# Altium schematic sheet sensing_circuits.SchDoc
size B
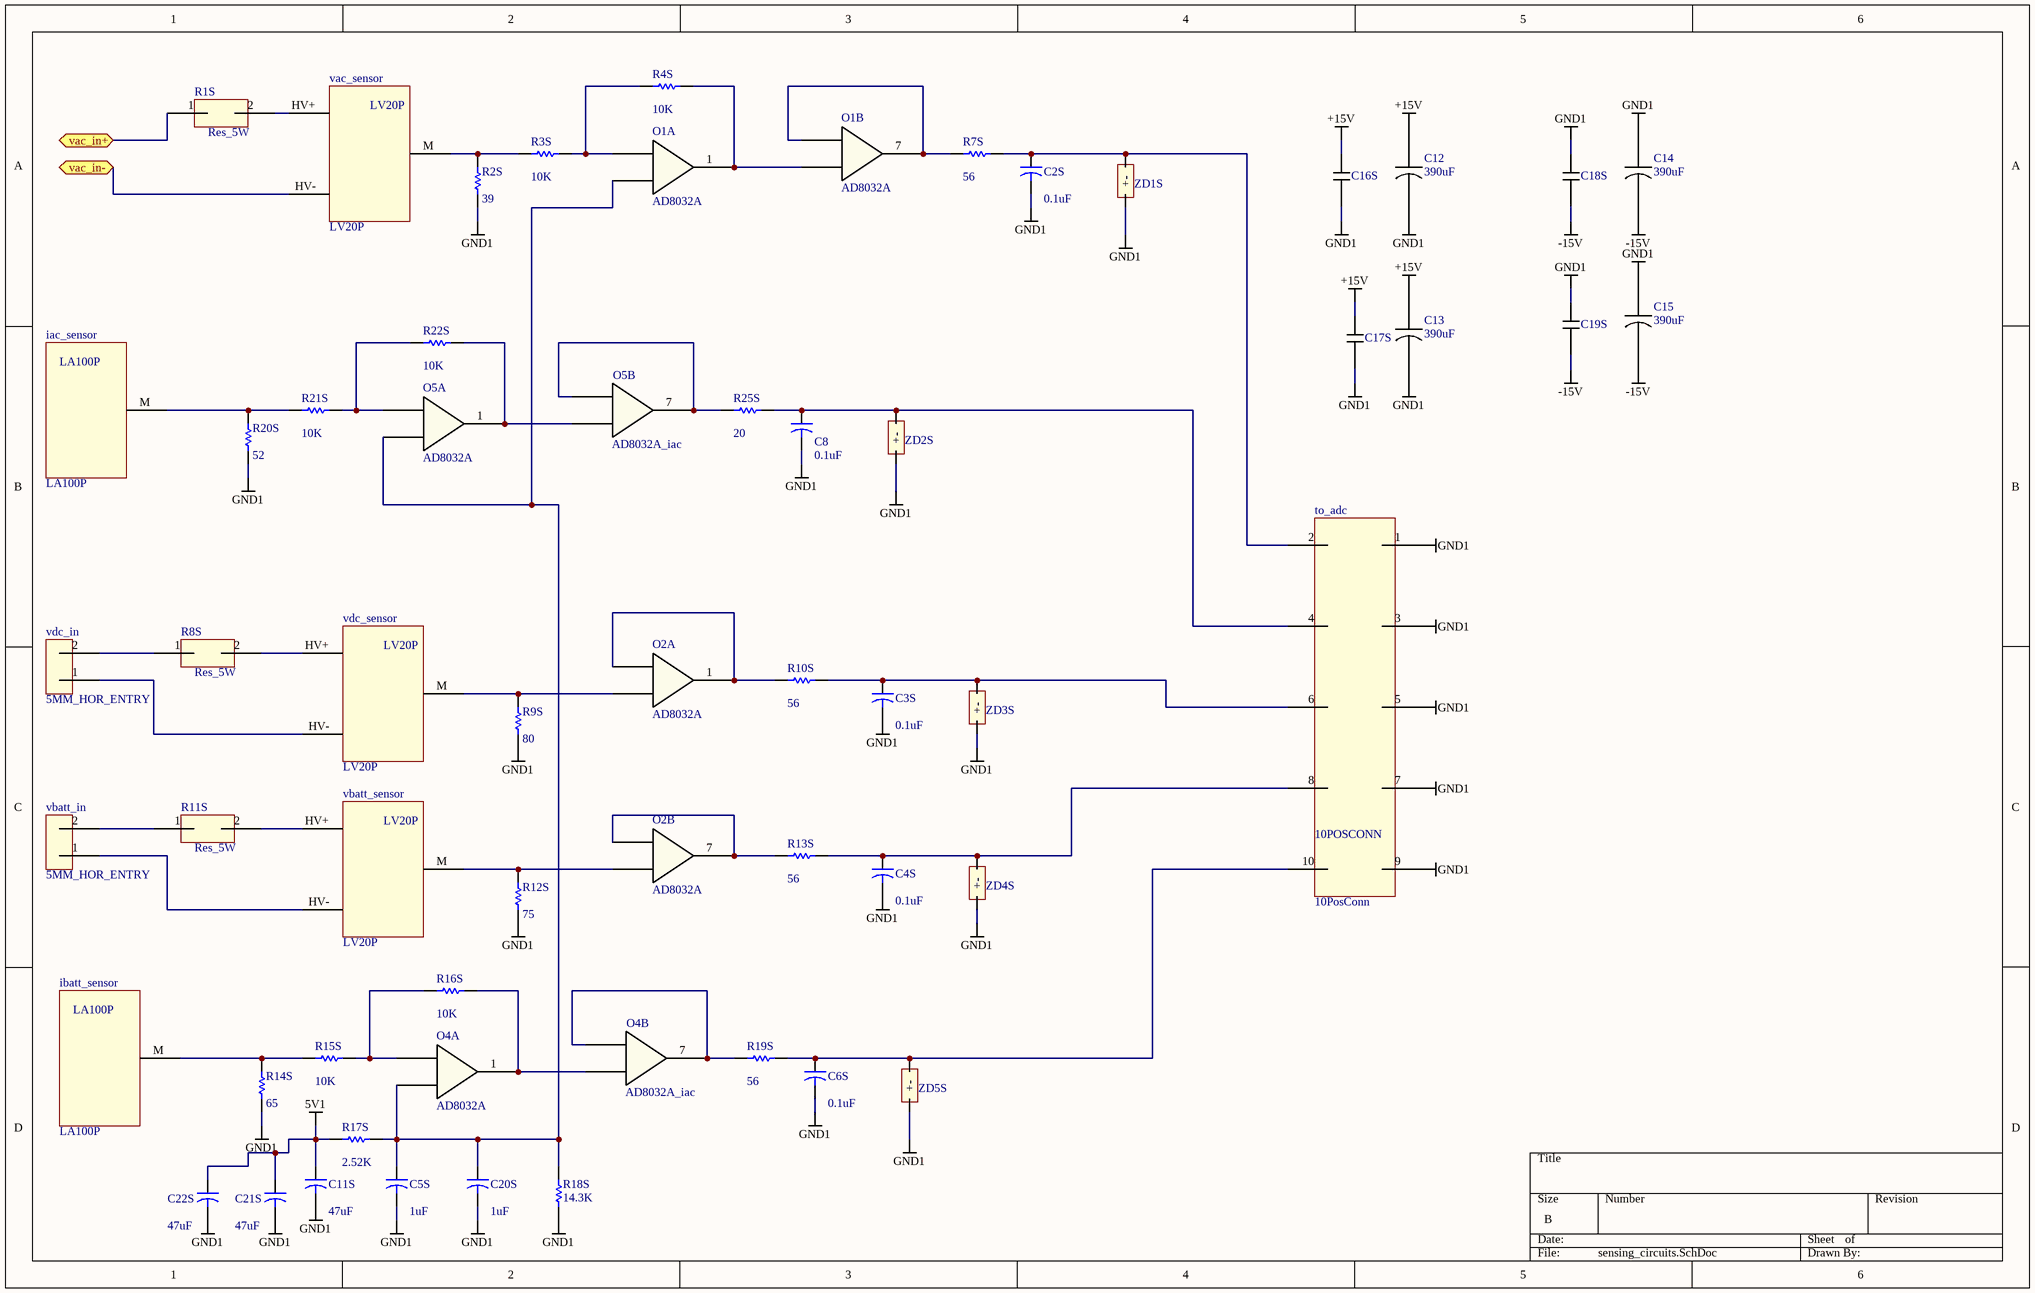
[diagram p0: sensing_circuits.SchDoc]

## Parts
C2S  value 0.1uF  [CAPR5-4X5]  (hidden comment: C2)
C3S  value 0.1uF  [CAPR5-4X5]  (hidden comment: C3)
C4S  value 0.1uF  [CAPR5-4X5]  (hidden comment: C4)
C5S  value 1uF  [CAPR5-4X5]  (hidden comment: C5)
C6S  value 0.1uF  [CAPR5-4X5]  (hidden comment: C6)
C8S  C8  value 0.1uF  [CAPR5-4X5]
C11S  value 47uF  [CAPR5-4X5]  (hidden comment: C11)
C12  Capacitance: 390uF  [Cap_Pol_5mm]  (hidden comment: C12)
C13  Capacitance: 390uF  [Cap_Pol_5mm]  (hidden comment: C12)
C14  Capacitance: 390uF  [Cap_Pol_5mm]  (hidden comment: C12)
C15  Capacitance: 390uF  [Cap_Pol_5mm]  (hidden comment: C12)
C16S  CAP_CERAM_5MM  [CAP_CERAM_5MM]  (value not drawn)
C17S  CAP_CERAM_5MM  [CAP_CERAM_5MM]  (value not drawn)
C18S  CAP_CERAM_5MM  [CAP_CERAM_5MM]  (value not drawn)
C19S  CAP_CERAM_5MM  [CAP_CERAM_5MM]  (value not drawn)
C20S  value 1uF  [CAPR5-4X5]  (hidden comment: C20)
C21S  value 47uF  [CAPR5-4X5]  (hidden comment: C21)
C22S  value 47uF  [CAPR5-4X5]  (hidden comment: C22)
iac_sensor  LA100P  [LA100P]
ibatt_sensor  LA100P  [LA100P]
O1  AD8032A  [AD8032A]  (parts A,B of 2)
O2  AD8032A  [AD8032A]  (parts A,B of 2)
O4  AD8032A  [AD8032A]  (parts A,B of 2)
O5  AD8032A  [AD8032A]  (parts A,B of 2)
R1S  R1  [Res_Vishay_5W]  (value not drawn)
R2S  value 39  [AXIAL-0.3]  (hidden comment: R2)
R3S  value 10K  [AXIAL-0.3]  (hidden comment: R3)
R4S  value 10K  [AXIAL-0.3]  (hidden comment: R4)
R7S  value 56  [AXIAL-0.3]  (hidden comment: R7)
R8S  R8  [Res_Vishay_5W]  (value not drawn)
R9S  value 80  [AXIAL-0.3]  (hidden comment: R9)
R10S  value 56  [AXIAL-0.3]  (hidden comment: R10)
R11S  R11  [Res_Vishay_5W]  (value not drawn)
R12S  value 75  [AXIAL-0.3]  (hidden comment: R12)
R13S  value 56  [AXIAL-0.3]  (hidden comment: R13)
R14S  value 65  [AXIAL-0.3]  (hidden comment: R14)
R15S  value 10K  [AXIAL-0.3]  (hidden comment: R15)
R16S  value 10K  [AXIAL-0.3]  (hidden comment: R16)
R17S  value 2.52K  [AXIAL-0.3]  (hidden comment: R17)
R18S  value 14.3K  [AXIAL-0.3]  (hidden comment: R18)
R19S  value 56  [AXIAL-0.3]  (hidden comment: R19)
R20S  value 52  [AXIAL-0.3]  (hidden comment: R20)
R21S  value 10K  [AXIAL-0.3]  (hidden comment: R21)
R22S  value 10K  [AXIAL-0.3]  (hidden comment: R22)
R25S  value 20  [AXIAL-0.3]  (hidden comment: R25)
to_adc  10PosConn  [Conn_10Pos]
vac_sensor  LV20P  [LV20P]
vbatt_in  5MM_HOR_ENTRY  [5MM_HOR_ENTRY]
vbatt_sensor  LV20P  [LV20P]
vdc_in  5MM_HOR_ENTRY  [5MM_HOR_ENTRY]
vdc_sensor  LV20P  [LV20P]
ZD1S  ZENER_0.4W  [ZENER400mW]  (value not drawn)
ZD2S  ZENER_0.4W  [ZENER400mW]  (value not drawn)
ZD3S  ZENER_0.4W  [ZENER400mW]  (value not drawn)
ZD4S  ZENER_0.4W  [ZENER400mW]  (value not drawn)
ZD5S  ZENER_0.4W  [ZENER400mW]  (value not drawn)

## Ports
vac_in+ (bidir), vac_in- (bidir)

## Nets
5V1: C11S.1 C21S.1 C22S.1 O1.8 O2.8 O4.8 O5.8 R17S.2
+15V: C12.1 C13.1 C16S.2 C17S.2 iac_sensor.+ ibatt_sensor.+ vac_sensor.+15V vbatt_sensor.+15V vdc_sensor.+15V
-15V: C14.2 C15.2 C18S.1 C19S.1 iac_sensor.- ibatt_sensor.- vac_sensor.-15V vbatt_sensor.-15V vdc_sensor.-15V
GND1: C2S.2 C3S.2 C4S.2 C5S.2 C6S.2 C8S.2 C11S.2 C12.2 C13.2 C14.1 C15.1 C16S.1 C17S.1 C18S.2 C19S.2 C20S.2 C21S.2 C22S.2 O1.4 O2.4 O4.4 O5.4 R2S.1 R9S.1 R12S.1 R14S.1 R18S.2 R20S.1 to_adc.1 to_adc.3 to_adc.5 to_adc.7 to_adc.9 ZD1S.1(+) ZD2S.1(+) ZD3S.1(+) ZD4S.1(+) ZD5S.1(+)
vac_in+: R1S.1 ; port vac_in+
vac_in-: vac_sensor.HV- ; port vac_in-
NetC2S_1: C2S.1 R7S.1 to_adc.2 ZD1S.2(-)
NetC3S_1: C3S.1 R10S.2 to_adc.6 ZD3S.2(-)
NetC4S_1: C4S.1 R13S.2 to_adc.8 ZD4S.2(-)
NetC5S_1: C5S.1 C20S.1 O1.3 O4.3 O5.3 R17S.1 R18S.1
NetC6S_1: C6S.1 R19S.1 to_adc.10 ZD5S.2(-)
NetC8S_1: C8S.1 R25S.1 to_adc.4 ZD2S.2(-)
Netiac_sensor_M: iac_sensor.M R20S.2 R21S.2
Netibatt_sensor_M: ibatt_sensor.M R14S.2 R15S.2
NetO1_1: O1.1 O1.5 R4S.1
NetO1_2: O1.2 R3S.1 R4S.2
NetO1_6: O1.6 O1.7 R7S.2
NetO2_1: O2.1 O2.2 R10S.1
NetO2_3: O2.3 R9S.2 vdc_sensor.M
NetO2_5: O2.5 R12S.2 vbatt_sensor.M
NetO2_6: O2.6 O2.7 R13S.1
NetO4_1: O4.1 O4.5 R16S.1
NetO4_2: O4.2 R15S.1 R16S.2
NetO4_6: O4.6 O4.7 R19S.2
NetO5_1: O5.1 O5.5 R22S.1
NetO5_2: O5.2 R21S.1 R22S.2
NetO5_6: O5.6 O5.7 R25S.2
NetR1S_2: R1S.2 vac_sensor.HV+
NetR2S_2: R2S.2 R3S.2 vac_sensor.M
NetR8S_1: R8S.1 vdc_in.2
NetR8S_2: R8S.2 vdc_sensor.HV+
NetR11S_1: R11S.1 vbatt_in.2
NetR11S_2: R11S.2 vbatt_sensor.HV+
Netvbatt_in_1: vbatt_in.1 vbatt_sensor.HV-
Netvdc_in_1: vdc_in.1 vdc_sensor.HV-

## Notes on the sheet
- (in symbol 10PosConn) 10POSCONN
- (in symbol Res_Vishay_5W) Res_5W

## Library data of the parts
C2S C3S C4S C5S C6S C8S C11S C20S C21S C22S = Cap2: Capacitor; Published: 23-Sep-2002; PackageReference: CAPR5-4X5; Publisher: Altium Limited; PackageDescription: Capacitor; 2 Leads
C12-C15 = Cap_Pol_5
R1S = Res_Vishay_5W: Resistance: 15k
R2S R3S R4S R7S R9S R10S R12S R13S R14S R15S R16S R17S R18S R19S R20S R21S R22S R25S = Res1: Resistor; Published: 8-Jun-2000; LatestRevisionDate: 17-Jul-2002; LatestRevisionNote: Re-released for DXP Platform.; PackageReference: AXIAL-0.3; Publisher: Altium Limited; PackageDescription: Axial Device, Thru-Hole; 2 Leads; 0.3 in Pin Spacing
R8S = Res_Vishay_5W: Resistance: 25k
R11S = Res_Vishay_5W: Resistance: 10k